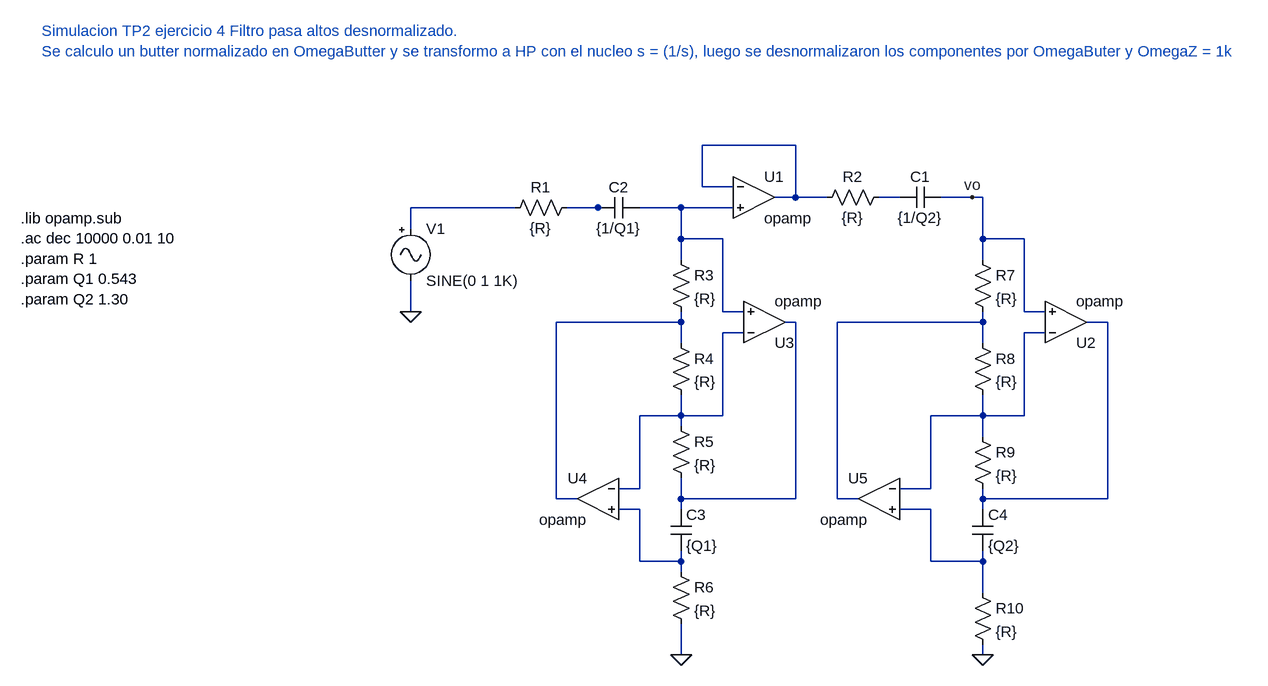
[diagram p0: schematic tp_2_4_normalizado_gic.asc]
tp_2_4_normalizado_gic.asc, the LTspice schematic file:
Version 4
SHEET 1 1224 992
WIRE 544 192 400 192
WIRE 400 256 400 192
WIRE 448 256 400 256
WIRE 544 272 544 192
WIRE 544 272 512 272
WIRE 592 272 544 272
WIRE 704 272 672 272
WIRE 816 272 768 272
WIRE 832 272 816 272
WIRE 112 288 -48 288
WIRE 240 288 192 288
WIRE 256 288 240 288
WIRE 368 288 304 288
WIRE 448 288 368 288
WIRE -48 320 -48 288
WIRE 368 336 368 288
WIRE 432 336 368 336
WIRE 832 336 832 272
WIRE 896 336 832 336
WIRE 368 368 368 336
WIRE 832 368 832 336
WIRE -48 448 -48 400
WIRE 432 448 432 336
WIRE 464 448 432 448
WIRE 896 448 896 336
WIRE 928 448 896 448
WIRE 368 464 368 448
WIRE 368 464 176 464
WIRE 544 464 528 464
WIRE 832 464 832 448
WIRE 832 464 608 464
WIRE 1024 464 992 464
WIRE 464 480 432 480
WIRE 928 480 896 480
WIRE 368 496 368 464
WIRE 832 496 832 464
WIRE 368 608 368 576
WIRE 368 608 304 608
WIRE 432 608 432 480
WIRE 432 608 368 608
WIRE 832 608 832 576
WIRE 832 608 752 608
WIRE 896 608 896 480
WIRE 896 608 832 608
WIRE 368 624 368 608
WIRE 832 640 832 608
WIRE 304 720 304 608
WIRE 304 720 272 720
WIRE 752 720 752 608
WIRE 752 720 704 720
WIRE 176 736 176 464
WIRE 208 736 176 736
WIRE 368 736 368 704
WIRE 544 736 544 464
WIRE 544 736 368 736
WIRE 608 736 608 464
WIRE 640 736 608 736
WIRE 832 736 832 720
WIRE 1024 736 1024 464
WIRE 1024 736 832 736
WIRE 304 752 272 752
WIRE 368 752 368 736
WIRE 752 752 704 752
WIRE 832 752 832 736
WIRE 304 832 304 752
WIRE 368 832 368 816
WIRE 368 832 304 832
WIRE 752 832 752 752
WIRE 832 832 832 816
WIRE 832 832 752 832
WIRE 368 848 368 832
WIRE 832 880 832 832
WIRE 368 976 368 928
WIRE 832 976 832 960
FLAG -48 448 0
FLAG 816 272 vo
FLAG 368 976 0
FLAG 832 976 0
SYMBOL Opamps/opamp 480 208 R0
SYMATTR InstName U1
SYMBOL res 208 272 R90
WINDOW 0 0 56 VBottom 2
WINDOW 3 32 56 VTop 2
SYMATTR InstName R1
SYMATTR Value {R}
SYMBOL res 688 256 R90
WINDOW 0 0 56 VBottom 2
WINDOW 3 32 56 VTop 2
SYMATTR InstName R2
SYMATTR Value {R}
SYMBOL cap 768 256 R90
WINDOW 0 0 32 VBottom 2
WINDOW 3 32 32 VTop 2
SYMATTR InstName C1
SYMATTR Value {1/Q2}
SYMBOL cap 304 272 R90
WINDOW 0 0 32 VBottom 2
WINDOW 3 32 32 VTop 2
SYMATTR InstName C2
SYMATTR Value {1/Q1}
SYMBOL Misc/signal -48 304 R0
SYMATTR InstName V1
SYMATTR Value2 AC 1
SYMBOL res 352 352 R0
SYMATTR InstName R3
SYMATTR Value {R}
SYMBOL res 352 480 R0
SYMATTR InstName R4
SYMATTR Value {R}
SYMBOL res 352 608 R0
SYMATTR InstName R5
SYMATTR Value {R}
SYMBOL res 352 832 R0
SYMATTR InstName R6
SYMATTR Value {R}
SYMBOL res 816 352 R0
SYMATTR InstName R7
SYMATTR Value {R}
SYMBOL res 816 480 R0
SYMATTR InstName R8
SYMATTR Value {R}
SYMBOL res 816 624 R0
SYMATTR InstName R9
SYMATTR Value {R}
SYMBOL res 816 864 R0
SYMATTR InstName R10
SYMATTR Value {R}
SYMBOL cap 352 752 R0
SYMATTR InstName C3
SYMATTR Value {Q1}
SYMBOL cap 816 752 R0
SYMATTR InstName C4
SYMATTR Value {Q2}
SYMBOL Opamps/opamp 960 528 M180
SYMATTR InstName U2
SYMBOL Opamps/opamp 496 528 M180
SYMATTR InstName U3
SYMBOL Opamps/opamp 240 672 M0
SYMATTR InstName U4
SYMBOL Opamps/opamp 672 672 M0
SYMATTR InstName U5
TEXT -648 304 Left 2 !.lib opamp.sub\n.ac dec 10000 0.01 10\n.param R 1\n.param Q1 0.543\n.param Q2 1.30
TEXT -616 16 Left 2 ;Simulacion TP2 ejercicio 4 Filtro pasa altos desnormalizado.\nSe calculo un butter normalizado en OmegaButter y se transformo a HP con el nucleo s = (1/s), luego se desnormalizaron los componentes por OmegaButer y OmegaZ = 1k

The netlist it stands for:
* tp_2_4_normalizado_gic.asc
XU1 N001 N005 N001 opamp Aol=100K GBW=10Meg  ; pins invin noninvin out
R1 N004 N003 {R}
R2 N002 N001 {R}
C1 vo N002 {1/Q2}
C2 N005 N004 {1/Q1}
V1 N003 0 SINE(0 1 1K) AC 1
R3 N005 N006 {R}
R4 N006 N010 {R}
R5 N010 N007 {R}
R6 N012 0 {R}
R7 vo N008 {R}
R8 N008 N011 {R}
R9 N011 N009 {R}
R10 N013 0 {R}
C3 N007 N012 {Q1}
C4 N009 N013 {Q2}
XU2 N011 vo N009 opamp Aol=100K GBW=10Meg  ; pins invin noninvin out
XU3 N010 N005 N007 opamp Aol=100K GBW=10Meg  ; pins invin noninvin out
XU4 N010 N012 N006 opamp Aol=100K GBW=10Meg  ; pins invin noninvin out
XU5 N011 N013 N008 opamp Aol=100K GBW=10Meg  ; pins invin noninvin out
.lib opamp.sub
.ac dec 10000 0.01 10
.param R 1
.param Q1 0.543
.param Q2 1.30
* Simulacion TP2 ejercicio 4 Filtro pasa altos desnormalizado.
* Se calculo un butter normalizado en OmegaButter y se transformo a HP con el nucleo s = (1/s), luego se desnormalizaron los componentes por OmegaButer y OmegaZ = 1k
.backanno
.end